# Altium schematic sheet Copy of car_controler_sch.SchDoc
size A4; SheetNumber: 1; SheetTotal: 1
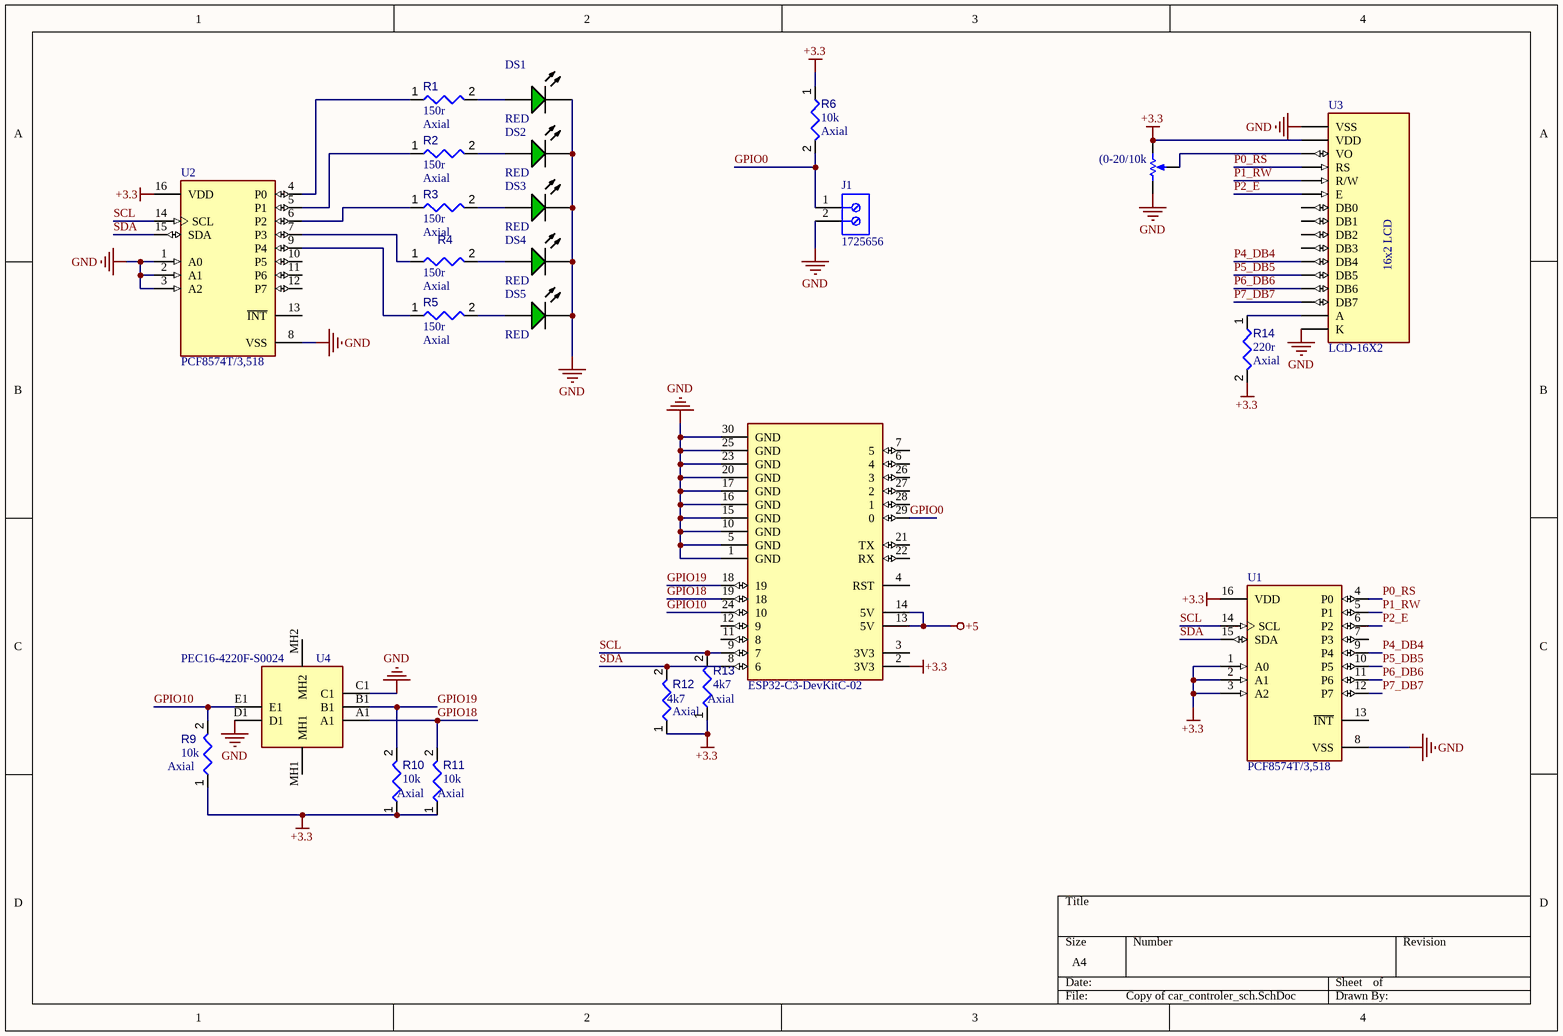
[diagram p0: Copy of car_controler_sch.SchDoc]

## Parts
(0-20/10k  3362P-1-104LF  [BOUR-3362P]  (value not drawn)
DS1  RED  [KING-WP7113SGD_V]
DS2  RED  [KING-WP7113SGD_V]
DS3  RED  [KING-WP7113SGD_V]
DS4  RED  [KING-WP7113SGD_V]
DS5  RED  [KING-WP7113SGD_V]
J1  1725656  [PHOE-1725656-2]
MD1  ESP32-C3-DevKitC-02  [FP-ESP32-C3-DevKitC-02-MFG]
R1  value 150r  Case/Package: Axial  [RESA60-630X240]  (hidden comment: Resistor 470r)
R2  value 150r  Case/Package: Axial  [RESA60-630X240]  (hidden comment: Resistor 470r)
R3  value 150r  Case/Package: Axial  [RESA60-630X240]  (hidden comment: Resistor 470r)
R4  value 150r  Case/Package: Axial  [RESA60-630X240]  (hidden comment: Resistor 470r)
R5  value 150r  Case/Package: Axial  [RESA60-630X240]  (hidden comment: Resistor 470r)
R6  value 10k  Case/Package: Axial  [RESA60-630X240]  (hidden comment: 4k7 resistor Axial)
R9  value 10k  Case/Package: Axial  [RESA60-630X240]  (hidden comment: 4k7 resistor Axial)
R10  value 10k  Case/Package: Axial  [RESA60-630X240]  (hidden comment: 4k7 resistor Axial)
R11  value 10k  Case/Package: Axial  [RESA60-630X240]  (hidden comment: 4k7 resistor Axial)
R12  value 4k7  Case/Package: Axial  [RESA60-630X240]  (hidden comment: 4k7 resistor Axial)
R13  value 4k7  Case/Package: Axial  [RESA60-630X240]  (hidden comment: 4k7 resistor Axial)
R14  value 220r  Case/Package: Axial  [RESA60-630X240]  (hidden comment: 4k7 resistor Axial)
U1  PCF8574T/3,518  [FP-SOT162-1-MFG]
U2  PCF8574T/3,518  [FP-SOT162-1-MFG]
U3  LCD-16X2  [MODULE_LCD-16X2]
U4  PEC16-4220F-S0024  [PEC164120FS0012]

## Nets
+3.3: (0-20/10k.3(CW) MD1.2(3V3) R6.1 R9.1 R10.1 R11.1 R12.1 R13.1 R14.2 U1.1(A0) U1.2(A1) U1.3(A2) U1.16(VDD) U2.16(VDD) U3.2(VDD)
+5: MD1.13(5V) MD1.14(5V)
GND: (0-20/10k.1(CCW) DS1.2(K) DS2.2(K) DS3.2(K) DS4.2(K) DS5.2(K) J1.2 MD1.1(GND) MD1.5(GND) MD1.10(GND) MD1.15(GND) MD1.16(GND) MD1.17(GND) MD1.20(GND) MD1.23(GND) MD1.25(GND) MD1.30(GND) U1.8(VSS) U2.1(A0) U2.2(A1) U2.3(A2) U2.8(VSS) U3.1(VSS) U3.16(K) U4.C1 U4.D1
GPIO0: J1.1 MD1.29(0) R6.2
GPIO10: MD1.24(10) R9.2 U4.E1
GPIO18: MD1.19(18) R11.2 U4.A1
GPIO19: MD1.18(19) R10.2 U4.B1
P0_RS: U1.4(P0) U3.4(RS)
P1_RW: U1.5(P1) U3.5(R/W)
P2_E: U1.6(P2) U3.6(E)
P4_DB4: U1.9(P4) U3.11(DB4)
P5_DB5: U1.10(P5) U3.12(DB5)
P6_DB6: U1.11(P6) U3.13(DB6)
P7_DB7: U1.12(P7) U3.14(DB7)
SCL: MD1.9(7) R13.2 U1.14(SCL) U2.14(SCL)
SDA: MD1.8(6) R12.2 U1.15(SDA) U2.15(SDA)
Net(0-20/10k_2: (0-20/10k.2(S) U3.3(VO)
NetDS1_1: DS1.1(A) R1.2
NetDS2_1: DS2.1(A) R2.2
NetDS3_1: DS3.1(A) R3.2
NetDS4_1: DS4.1(A) R4.2
NetDS5_1: DS5.1(A) R5.2
NetR1_1: R1.1 U2.4(P0)
NetR2_1: R2.1 U2.5(P1)
NetR3_1: R3.1 U2.6(P2)
NetR4_1: R4.1 U2.7(P3)
NetR5_1: R5.1 U2.9(P4)
NetR14_1: R14.1 U3.15(A)

Not connected (* = marked no-connect by the designer): MD1 3(3V3) 4(RST) 6(4) 7(5) 11(8) 12(9) 21(TX) 22(RX) 26(3) 27(2) 28(1); U1 7(P3) 13(~{INT}); U2 10(P5) 11(P6) 12(P7) 13(~{INT}); U3 7(DB0) 8(DB1) 9(DB2) 10(DB3); U4 MH1 MH2

## Notes on the sheet
- (in symbol LCD-16X2) 16x2 LCD

## Library data of the parts
(0-20/10k = CMP-009-00040-2: Square Trimpot(R) Trimming Potentiometer, 100 KOhm, 300 V, -55 to 125 degC, 3-Pin THD, RoHS, Tube; Manufacturer: Bourns; Resistance: 100k; Tolerance: 10%; Voltage Rating: 300V; Power: 500mW; Package Quantity: 250; RoHS Compliant: True; Package Reference: 3326P; Mounting Technology: TH; Case/Package: 3326P; Composition: Potentiometer; Datasheet Version: May-16; Manufacturer URL: http://www.bourns.com/; Package Description: 3-Pin Through Hole Device, Body 6.6 x 6.99 mm, Pitch 2.54 mm; Min Operating Temperature: -55°C; Max Operating Temperature: 125°C; Packaging: Rail/Tube; Datasheet URL: http://www.bourns.com/docs/Product-Datasheets/3362.pdf; Lead Pitch: 2.54mm; Manufacturer Part Number: 3362P-1-104LF; Component Type: Resistors
DS1-DS5 = CMP-007-00010-1: LED Green, 62.5 mW, 25 mA, -40 to 85 degC, 2-Pin THD, RoHS, Bulk; Manufacturer: Kingbright; Manufacturer Part Number: WP7113SGD; Viewing Angle: 30degrees; Forward Voltage: 2.2V; Lens Style: Dome; Power: 62.5mW; Luminous Intensity: 40mcd; Illumination Colour: Green; Datasheet Version: Rev. 6B, 01/2015; Colour: Green; Mounting Technology: TH; Nominal Vf: 2.2V; Package Description: 2-Pin Through Hole Device, Dia 5.9 mm, Body Length 8.6 mm; Package Quantity: 1000; Case/Package: Radial; RoHS Compliant: True; Packaging: Bulk; Package Reference: WP7113SGD; Datasheet URL: http://www.kingbrightusa.com/images/catalog/SPEC/WP7113SGD.pdf; Component Type: LED
J1 = CMP-2000-05299-1: Male Header, Pitch 2.54 mm, 1 x 2 Position, Height 9 mm, Tail Length 3.5 mm; Manufacturer: Phoenix Contact; Number of contacts: 2; Content: 250pc(s); Pitch: 2.54mm; Industrial packaging: Yes; Colour: Green; Manufacturer part No.: 1725656; Type: MPT0,5/2-2,54; Datasheet URL: http://datasheet.octopart.com/1725656-Phoenix-Contact-datasheet-5302866.pdf; Manufacturer URL: http://www.phoenixcontact.com/; Datasheet Version: Apr-08
MD1 = CMP-194061-000001-1: ESP32-C3-WROOM-02 DEV BRD
R1-R5 = CMP-009-00177-3: Axial Resistor, 470 Ohm; Mounting Technology: TH; Package Description: 2-Pin Axial Lead, Dia 2.4 mm, Body Length 6.3 mm; Component Type: Resistors
R6 R9-R14 = CMP-009-00178-1: Axial Resistor, 4.7 KOhm; Tolerance: 1%; Package Description: 2-Pin Axial Lead, Dia 2.4 mm, Body Length 6.3 mm; Component Type: Resistors
U1 U2 = CMP-10112-000010-1: IC I/O EXPANDER I2C 8B 16SOIC; Manufacturer: NXP Semiconductors; Frequency: 100kHz; Max Supply Voltage: 6V; Standoff Height: 0.1mm; Nominal Supply Current: 40uA; Max Junction Temp: +125°C; Min Supply Voltage: 2.5V; Number Of I/Os: 8; Manufacturer Part Number: PCF8574T/3,518; Footprint Url: https://www.nxp.com/docs/en/package-information/SOT162-1.pdf; ComponentLink2URL: https://www.nxp.com/docs/en/data-sheet/PCF8574_PCF8574A.pdf; Automotive: No; Digikey Description: IC I/O EXPANDER I2C 8B 16SOIC; Mouser Description: PCF8574 Series 2.5 - 6V Remote 8-bit I/O Expander for I2C-bus - SOIC-16; Ipc Land Pattern Name: SOIC127P1032X265-16; Interface: I2C; Octopart: https://octopart.com/pcf8574t%2F3%2C518-nxp+semiconductors-10470852; Ambient Temperature Range Low: -40°C; Lead Free: Yes; Device Class L2: Interface ICs; Temperature Range High: +85°C; Device Class L1: Integrated Circuits (ICs); Package: SOT162-1; ComponentLink2Description: Datasheet; Device Class L3: I/O Expanders; Temperature: -40°C to +85°C; Ambient Temperature Range High: +85°C; Height: 2.65mm; Category: IC; RoHS: TRUE; Temperature Range Low: -40°C
U3 = LCD-16X2: Display Development Tools 16x2 Black on Green Char LCD w Backlight; MF: Gravitech; Package: None; Price: None; Value: *; SnapEDA_Link: https://www.snapeda.com/parts/LCD-16X2/Gravitech/view-part/?ref=snap; MP: LCD-16X2; Availability: Not in stock; Check_prices: https://www.snapeda.com/parts/LCD-16X2/Gravitech/view-part/?ref=eda
U4 = PEC16-4220F-S0024: Undefined or Miscellaneous; Manufacturer_Name: Bourns; Datasheet Link: https://www.bourns.com/pdfs/PEC16.pdf; Height: 28mm; Manufacturer_Part_Number: PEC16-4220F-S0024; Arrow Part Number: PEC16-4220F-S0024; Arrow Price/Stock: null?utm_currency=USD&region=nac